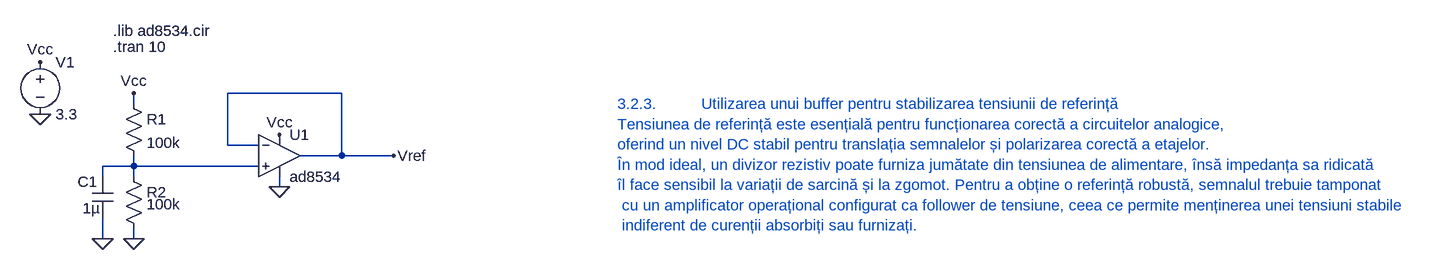
[diagram p0: schematic TensiuneReferinta.asc]
TensiuneReferinta.asc, the LTspice schematic file:
Version 4.1
SHEET 1 1944 680
WIRE 320 80 144 80
WIRE 0 96 0 80
WIRE 144 160 144 80
WIRE 192 160 144 160
WIRE 320 176 320 80
WIRE 320 176 256 176
WIRE 400 176 320 176
WIRE 0 192 0 176
WIRE 0 192 -48 192
WIRE 192 192 0 192
WIRE -48 208 -48 192
WIRE 0 208 0 192
WIRE 224 224 224 208
WIRE -48 304 -48 272
WIRE 0 304 0 288
FLAG 400 176 Vref
FLAG 224 224 0
FLAG 0 80 Vcc
FLAG 0 304 0
FLAG -48 304 0
FLAG 224 144 Vcc
FLAG -144 112 0
FLAG -144 32 Vcc
SYMBOL OpAmps\\opamp2 224 112 R0
SYMATTR InstName U1
SYMATTR Value ad8534
SYMBOL res -16 80 R0
SYMATTR InstName R1
SYMATTR Value 100k
SYMBOL res -16 192 R0
WINDOW 3 36 59 Left 2
SYMATTR Value 100k
SYMATTR InstName R2
SYMBOL cap -32 272 R180
WINDOW 0 24 56 Left 2
WINDOW 3 20 15 Left 2
SYMATTR InstName C1
SYMATTR Value 1µ
SYMBOL voltage -144 16 R0
SYMATTR InstName V1
SYMATTR Value 3.3
TEXT -32 8 Left 2 !.tran 10
TEXT -32 -16 Left 2 !.lib ad8534.cir
TEXT 744 96 Left 2 ;3.2.3.          Utilizarea unui buffer pentru stabilizarea tensiunii de referință\nTensiunea de referință este esențială pentru funcționarea corectă a circuitelor analogice, \noferind un nivel DC stabil pentru translația semnalelor și polarizarea corectă a etajelor. \nÎn mod ideal, un divizor rezistiv poate furniza jumătate din tensiunea de alimentare, însă impedanța sa ridicată \nîl face sensibil la variații de sarcină și la zgomot. Pentru a obține o referință robustă, semnalul trebuie tamponat\n cu un amplificator operațional configurat ca follower de tensiune, ceea ce permite menținerea unei tensiuni stabile\n indiferent de curenții absorbiți sau furnizați.

The netlist it stands for:
* TensiuneReferinta.asc
X§U1 N001 Vref Vcc 0 Vref ad8534  ; pins In+ In- V+ V- OUT
R1 Vcc N001 100k
R2 N001 0 100k
C1 0 N001 1µ
V1 Vcc 0 3.3
.tran 10
.lib ad8534.cir
* 3.2.3.          Utilizarea unui buffer pentru stabilizarea tensiunii de referință
* Tensiunea de referință este esențială pentru funcționarea corectă a circuitelor analogice,
* oferind un nivel DC stabil pentru translația semnalelor și polarizarea corectă a etajelor.
* În mod ideal, un divizor rezistiv poate furniza jumătate din tensiunea de alimentare, însă impedanța sa ridicată
* îl face sensibil la variații de sarcină și la zgomot. Pentru a obține o referință robustă, semnalul trebuie tamponat
*  cu un amplificator operațional configurat ca follower de tensiune, ceea ce permite menținerea unei tensiuni stabile
*  indiferent de curenții absorbiți sau furnizați.
.backanno
.end